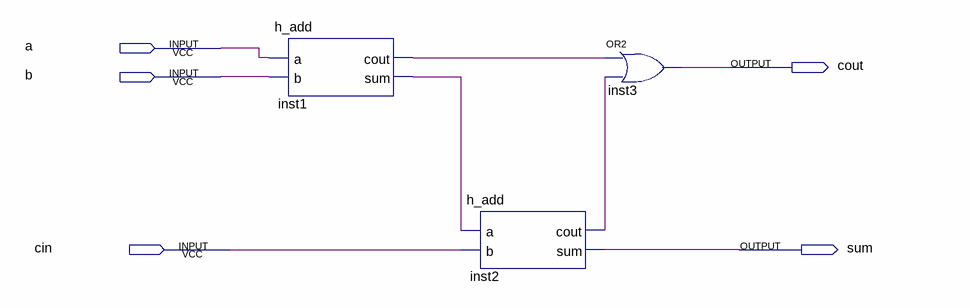
[diagram p0: schematic sheet]
// Quartus schematic add_1.bdf as structural Verilog: 3 symbols, 5 pins
module add_1 (
  input  a,
  input  b,
  input  cin,
  output cout,
  output sum
);

  wire inst1_cout, inst1_sum, inst2_cout;

  h_add inst1 (.a(a), .b(b), .cout(inst1_cout), .sum(inst1_sum));
  h_add inst2 (.a(inst1_sum), .b(cin), .cout(inst2_cout), .sum(sum));
  or inst3 (cout, inst1_cout, inst2_cout);
endmodule
